# Altium schematic sheet Modular_S2G1_Pinout_Diagram.SchDoc: <Project Name>
size A3; ApprovedBy: <Appr.>; Author: <Author>; CompanyName: Infineon Technologies AG; Engineer: <Rel.>; Organization: Infineon Technologies AG; Address1: IFAG DES S PS; Address2: Am Campeon 1-12  -  85579 Neubiberg  -  Germany; Address3: 85579 Neubiberg; Address4: Germany; Revision: <Rev.>; Release: RC00; PageSetup: Record=PageOptions|CenterHorizontal=True|CenterVertical=True|PrintScale=1.01|XCorrection=1.00|YCorrection=1.00|PrintKind=0|BorderSize=5000000|LeftOffset=0|BottomOffset=0|Orientation=2|PaperLength=1000|PaperWidth=1000|Scale=100|PaperSource=7|PrintQuality=-4|MediaType=1|DitherType=10|PaperKind=A3|PrintScaleMode=1; Doc_ConfidentialStatus: <Doc_ConfidentialStatus>; Doc_Preliminary: <Doc_Preliminary>
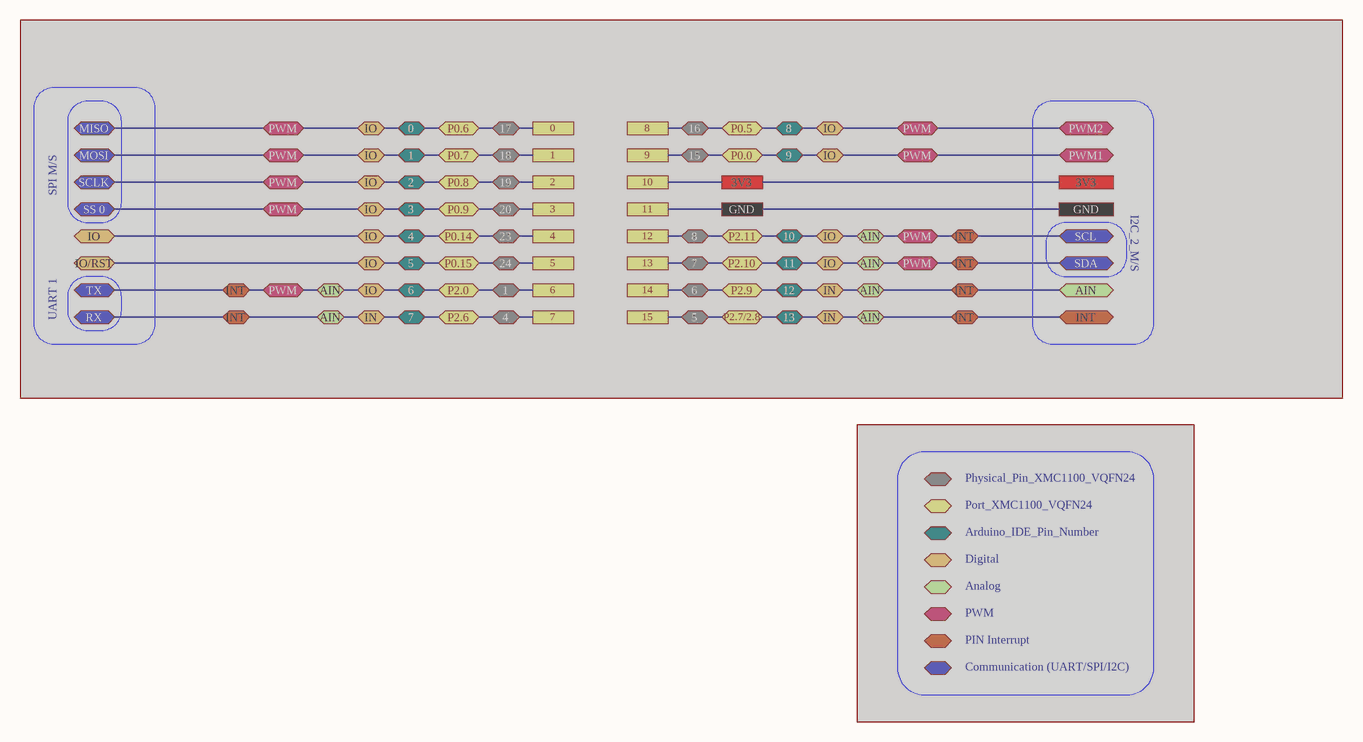
[diagram p0: Modular_S2G1_Pinout_Diagram.SchDoc]

## Ports
0, 0 (bidir), 1, 1 (bidir), 2, 2 (bidir), 3, 3 (bidir), 3V3, 4, 4 (bidir), 5, 5 (bidir), 6, 6 (bidir), 7, 7 (bidir), 8, 8 (bidir), 9, 9 (bidir), 10, 10 (bidir), 11, 11 (bidir), 12, 12 (bidir), 13, 13 (bidir), 14, 15, 15 (bidir), 16 (bidir), 17 (bidir), 18 (bidir), 19 (bidir), 20 (bidir), 23 (bidir), 24 (bidir),  (bidir), AIN (bidir), GND, IN (bidir), INT (bidir), IO (bidir), IO/RST (bidir), MISO (bidir), MOSI (bidir), P0.0 (bidir), P0.5 (bidir), P0.6 (bidir), P0.7 (bidir), P0.8 (bidir), P0.9 (bidir), P0.14 (bidir), P0.15 (bidir), P2.0 (bidir), P2.6 (bidir), P2.7/2.8 (bidir), P2.9 (bidir), P2.10 (bidir), P2.11 (bidir), PWM1 (bidir), PWM2 (bidir), PWM (bidir), RX (bidir), SCL (bidir), SCLK (bidir), SDA (bidir), SS 0 (bidir), TX (bidir)

## Notes on the sheet
- SPI M/S
- I2C_2_M/S
- UART 1
- Physical_Pin_XMC1100_VQFN24
- Port_XMC1100_VQFN24
- Arduino_IDE_Pin_Number
- Digital
- Analog
- PWM
- Communication (UART/SPI/I2C)
- PIN Interrupt
- Title
- Variant
- Approved
- Date:
- Author:
- Size:
- A3
- Document Name
- Time:
- SVN Revision:
- Rel.
- Rev.
- Sheet
- of